# EAGLE schematic Microboard PCB (EAGLE 6.5.0)
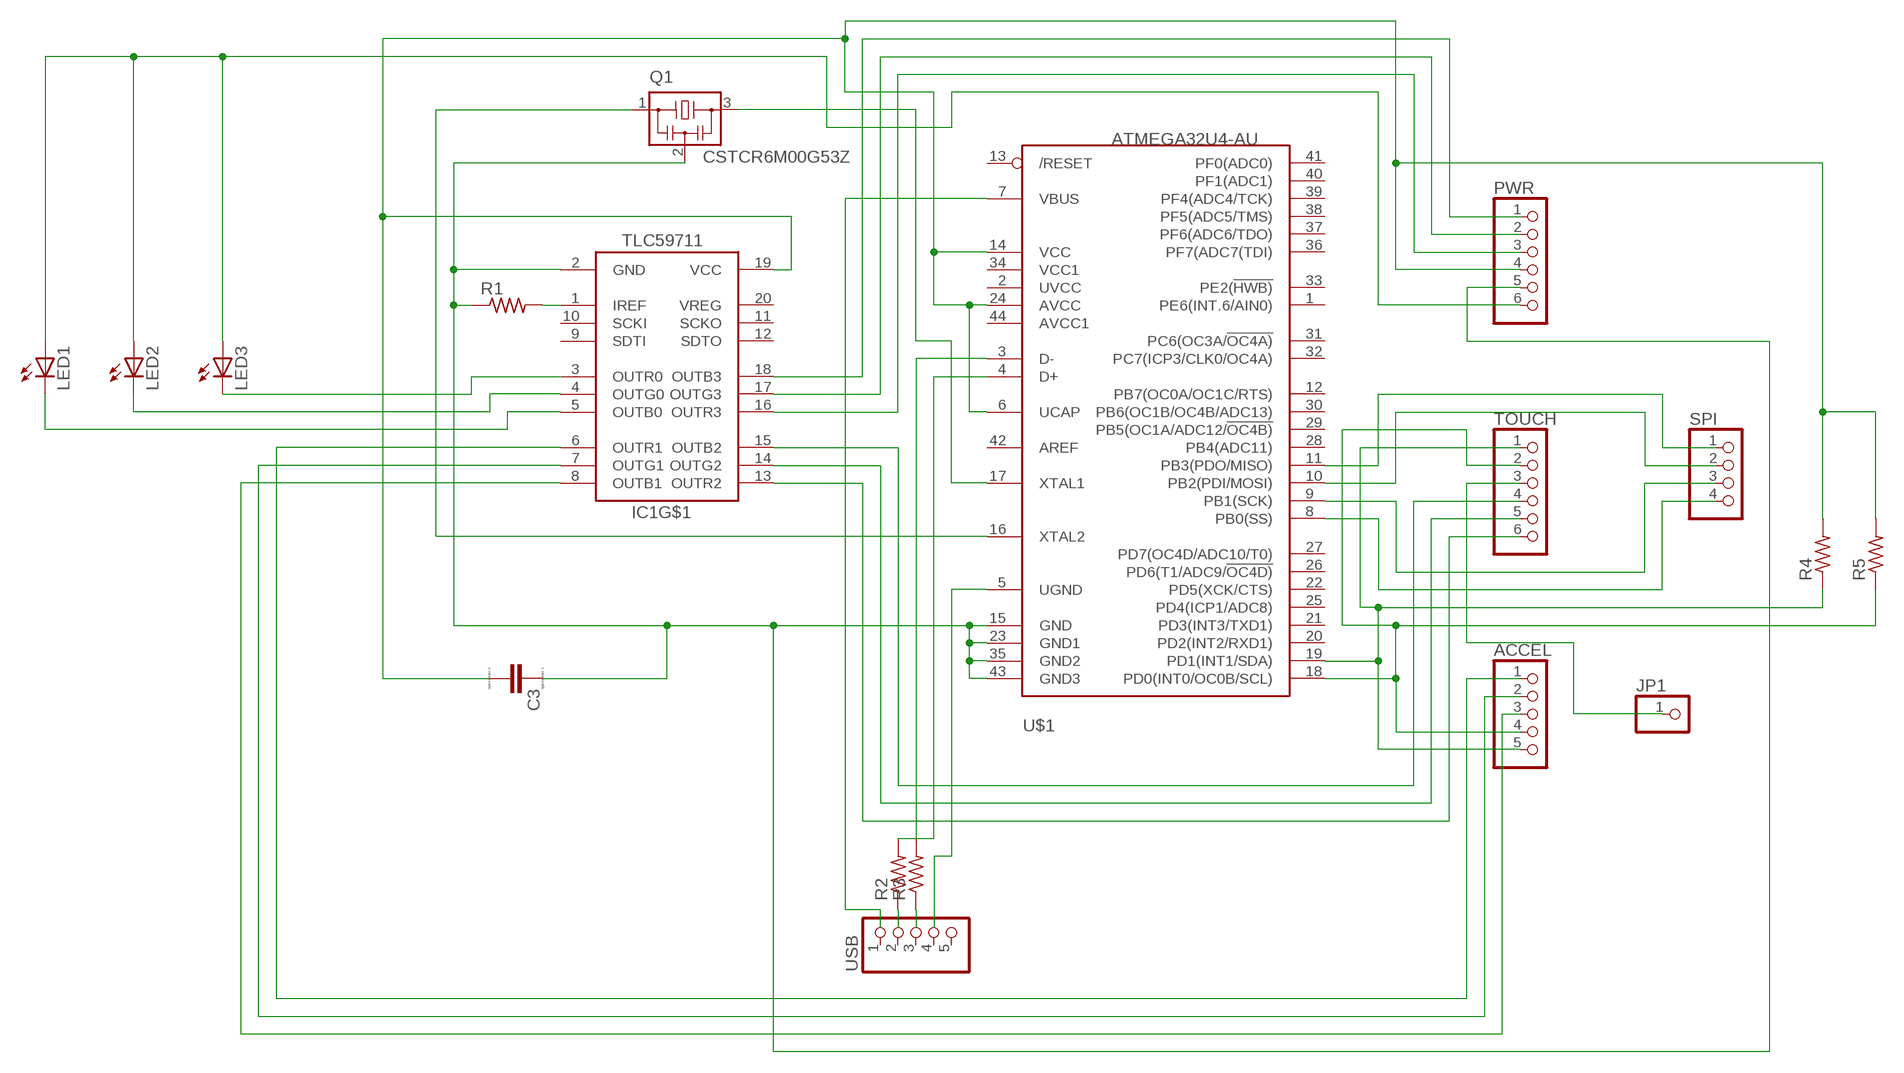
[diagram p0: schematic, sheet 1]

## Parts
ACCEL  PINHD-1X5  [1X05]
C3  CC0603  [C0603]
IC1  TLC59711  [HTSSOP20DAP]
JP1  PINHD-1X1  [1X01]
LED1  LEDP-LCC-4  [P-LCC-4]
LED2  LEDP-LCC-4  [P-LCC-4]
LED3  LEDP-LCC-4  [P-LCC-4]
PWR  PINHD-1X6  [1X06]
Q1  CSTCR6M00G53Z  [CSTCR6M]
R1  R-US_R0805  [R0805]
R2  R-US_R0805  [R0805]
R3  R-US_R0805  [R0805]
R4  R-US_R0805  [R0805]
R5  R-US_R0805  [R0805]
SPI  PINHD-1X4  [1X04]
TOUCH  PINHD-1X6  [1X06]
U$1  ATMEGA32U4-AU  [TQFP44]
USB  PINHD-1X5  [1X05]

## Nets
N$1: C3.1 IC1.2(GND) PWR.5 Q1.2 R1.1 U$1.15(GND) U$1.23(GND1) U$1.35(GND2) U$1.43(GND3)
N$2: IC1.1(IREF) R1.2
N$3: IC1.18(OUTB3) PWR.1
N$4: IC1.17(OUTG3) PWR.2
N$5: IC1.16(OUTR3) PWR.3
N$6: IC1.15(OUTB2) TOUCH.4
N$7: IC1.14(OUTG2) TOUCH.5
N$8: IC1.13(OUTR2) TOUCH.6
N$9: ACCEL.1 IC1.6(OUTR1)
N$10: ACCEL.2 IC1.7(OUTG1)
N$11: ACCEL.3 IC1.8(OUTB1)
N$12: U$1.7(VBUS)
N$13: R3.2 U$1.3(D-)
N$14: R2.2 U$1.4(D+)
N$15: U$1.5(UGND)
N$16: R3.1
N$17: R2.1
N$18: Q1.3 U$1.17(XTAL1)
N$19: Q1.1 U$1.16(XTAL2)
N$20: C3.2 IC1.19(VCC) PWR.4 R4.2 R5.2 U$1.6(UCAP) U$1.14(VCC) U$1.24(AVCC)
N$21: SPI.2 U$1.10(PB2(PDI/MOSI))
N$22: SPI.1 U$1.11(PB3(PDO/MISO))
N$23: SPI.3 U$1.9(PB1(SCK))
N$24: SPI.4 U$1.8(PB0(SS))
N$25: IC1.3(OUTR0) LED3.C@4(C)
N$26: IC1.4(OUTG0) LED2.C@4(C)
N$27: IC1.5(OUTB0) LED1.C@4(C)
N$28: LED1.A LED2.A LED3.A PWR.6
N$29: ACCEL.5 R4.1 TOUCH.1 U$1.19(PD1(INT1/SDA))
N$30: ACCEL.4 R5.1 TOUCH.2 U$1.18(PD0(INT0/OC0B/SCL))
N$33: JP1.1 TOUCH.3
Unconnected: IC1.9(SDTI) IC1.10(SCKI) IC1.11(SCKO) IC1.12(SDTO) IC1.20(VREG) IC1.EXP(PAD) U$1.1(PE6(INT.6/AIN0)) U$1.2(UVCC) U$1.12(PB7(OC0A/OC1C/RTS)) U$1.13(/RESET) U$1.20(PD2(INT2/RXD1)) U$1.21(PD3(INT3/TXD1)) U$1.22(PD5(XCK/CTS)) U$1.25(PD4(ICP1/ADC8)) U$1.26(PD6(T1/ADC9/!OC4D)) U$1.27(PD7(OC4D/ADC10/T0)) U$1.28(PB4(ADC11)) U$1.29(PB5(OC1A/ADC12/!OC4B)) U$1.30(PB6(OC1B/OC4B/ADC13)) U$1.31(PC6(OC3A/!OC4A)) U$1.32(PC7(ICP3/CLK0/OC4A)) U$1.33(PE2(!HWB)) U$1.34(VCC1) U$1.36(PF7(ADC7(TDI)) U$1.37(PF6(ADC6/TDO)) U$1.38(PF5(ADC5/TMS)) U$1.39(PF4(ADC4/TCK)) U$1.40(PF1(ADC1)) U$1.41(PF0(ADC0)) U$1.42(AREF) U$1.44(AVCC1) USB.1 USB.2 USB.3 USB.4 USB.5

## Library data of the parts
ACCEL USB = pinhead:PINHD-1X5: PIN HEADER
C3 = eagle-ltspice:C: CAPACITOR, European symbol; SPICEMODEL: NONE; SPICEPREFIX: C
IC1 = adafruit:TLC59711
JP1 = pinhead:PINHD-1X1: PIN HEADER
LED1-LED3 = led:LED: LED OSRAM: - CHIPLED LG R971, LG N971, LY N971, LG Q971, LY Q971, LO R971, LY R971 LH N974, LH R974 LS Q976, LO Q976, LY Q976 LO Q996 - Hyper CHIPLED LW Q18S LB Q993, LB Q99A, LB R99A - SideLED LS A670, LO A670, LY A670, LG A670, LP A670 LB A673, LV A673, LT A673, LW A673 LH A674 LY A675 LS A676, LA A676, LO A676, LY A676, LW A676 LS A679, LY A679, LG A679 - Hyper Micro SIDELED® LS Y876, LA Y876, LO Y876, LY Y876 LT Y87S - SmartLED LW L88C, LW L88S LB L89C, LB L89S, LG L890 LS L89K, LO L89K, LY L89K LS L896, LA L896, LO L896, LY L896 - TOPLED LS T670, LO T670, LY T670, LG T670, LP T670 LSG T670, LSP T670, LSY T670, LOP T670, LYG T670 LG T671, LOG T671, LSG T671 LB T673, LV T673, LT T673, LW T673 LH T674 LS T676, LA T676, LO T676, LY T676, LB T676, LH T676, LSB T676, LW T676 LB T67C, LV T67C, LT T67C, LS T67K, LO T67K, LY T67K, LW E67C LS E67B, LA E67B, LO E67B, LY E67B, LB E67C, LV E67C, LT E67C LW T67C LS T679, LY T679, LG T679 LS T770, LO T770, LY T770, LG T770, LP T770 LB T773, LV T773, LT T773, LW T773 LH T774 LS E675, LA E675, LY E675, LS T675 LS T776, LA T776, LO T776, LY T776, LB T776 LHGB T686 LT T68C, LB T68C - Hyper Mini TOPLED® LB M676 - Mini TOPLED Santana® LG M470 LS M47K, LO M47K, LY M47K Source: http://www.osram.convergy.de LUXEON: - LUMILED® LXK2-PW12-R00, LXK2-PW12-S00, LXK2-PW14-U00, LXK2-PW14-V00 LXK2-PM12-R00, LXK2-PM12-S00, LXK2-PM14-U00 LXK2-PE12-Q00, LXK2-PE12-R00, LXK2-PE12-S00, LXK2-PE14-T00, LXK2-PE14-U00 LXK2-PB12-K00, LXK2-PB12-L00, LXK2-PB12-M00, LXK2-PB14-N00, LXK2-PB14-P00, LXK2-PB14-Q00 LXK2-PR12-L00, LXK2-PR12-M00, LXK2-PR14-Q00, LXK2-PR14-R00 LXK2-PD12-Q00, LXK2-PD12-R00, LXK2-PD12-S00 LXK2-PH12-R00, LXK2-PH12-S00 LXK2-PL12-P00, LXK2-PL12-Q00, LXK2-PL12-R00 Source: www.luxeon.com KINGBRIGHT: KA-3528ASYC Source: www.kingbright.com
PWR TOUCH = pinhead:PINHD-1X6: PIN HEADER
Q1 = murata-filter:CSTCR: Resonator Source: murata.co.jp; MPN: CSTCR6M00G53-R0; OC_FARNELL: 1170434; OC_NEWARK: 25M8759
R1-R5 = resistor:R-US_: RESISTOR, American symbol
SPI = pinhead:PINHD-1X4: PIN HEADER
U$1 = adafruit:ATMEGA32U4: http://www.ladyada.net/library/eagle